# EAGLE design BATT_CPU (EAGLE 9.6.2)
COMPANY: ADAFRUIT INDUSTRIES; DRAWN: KTOWN; REV: B
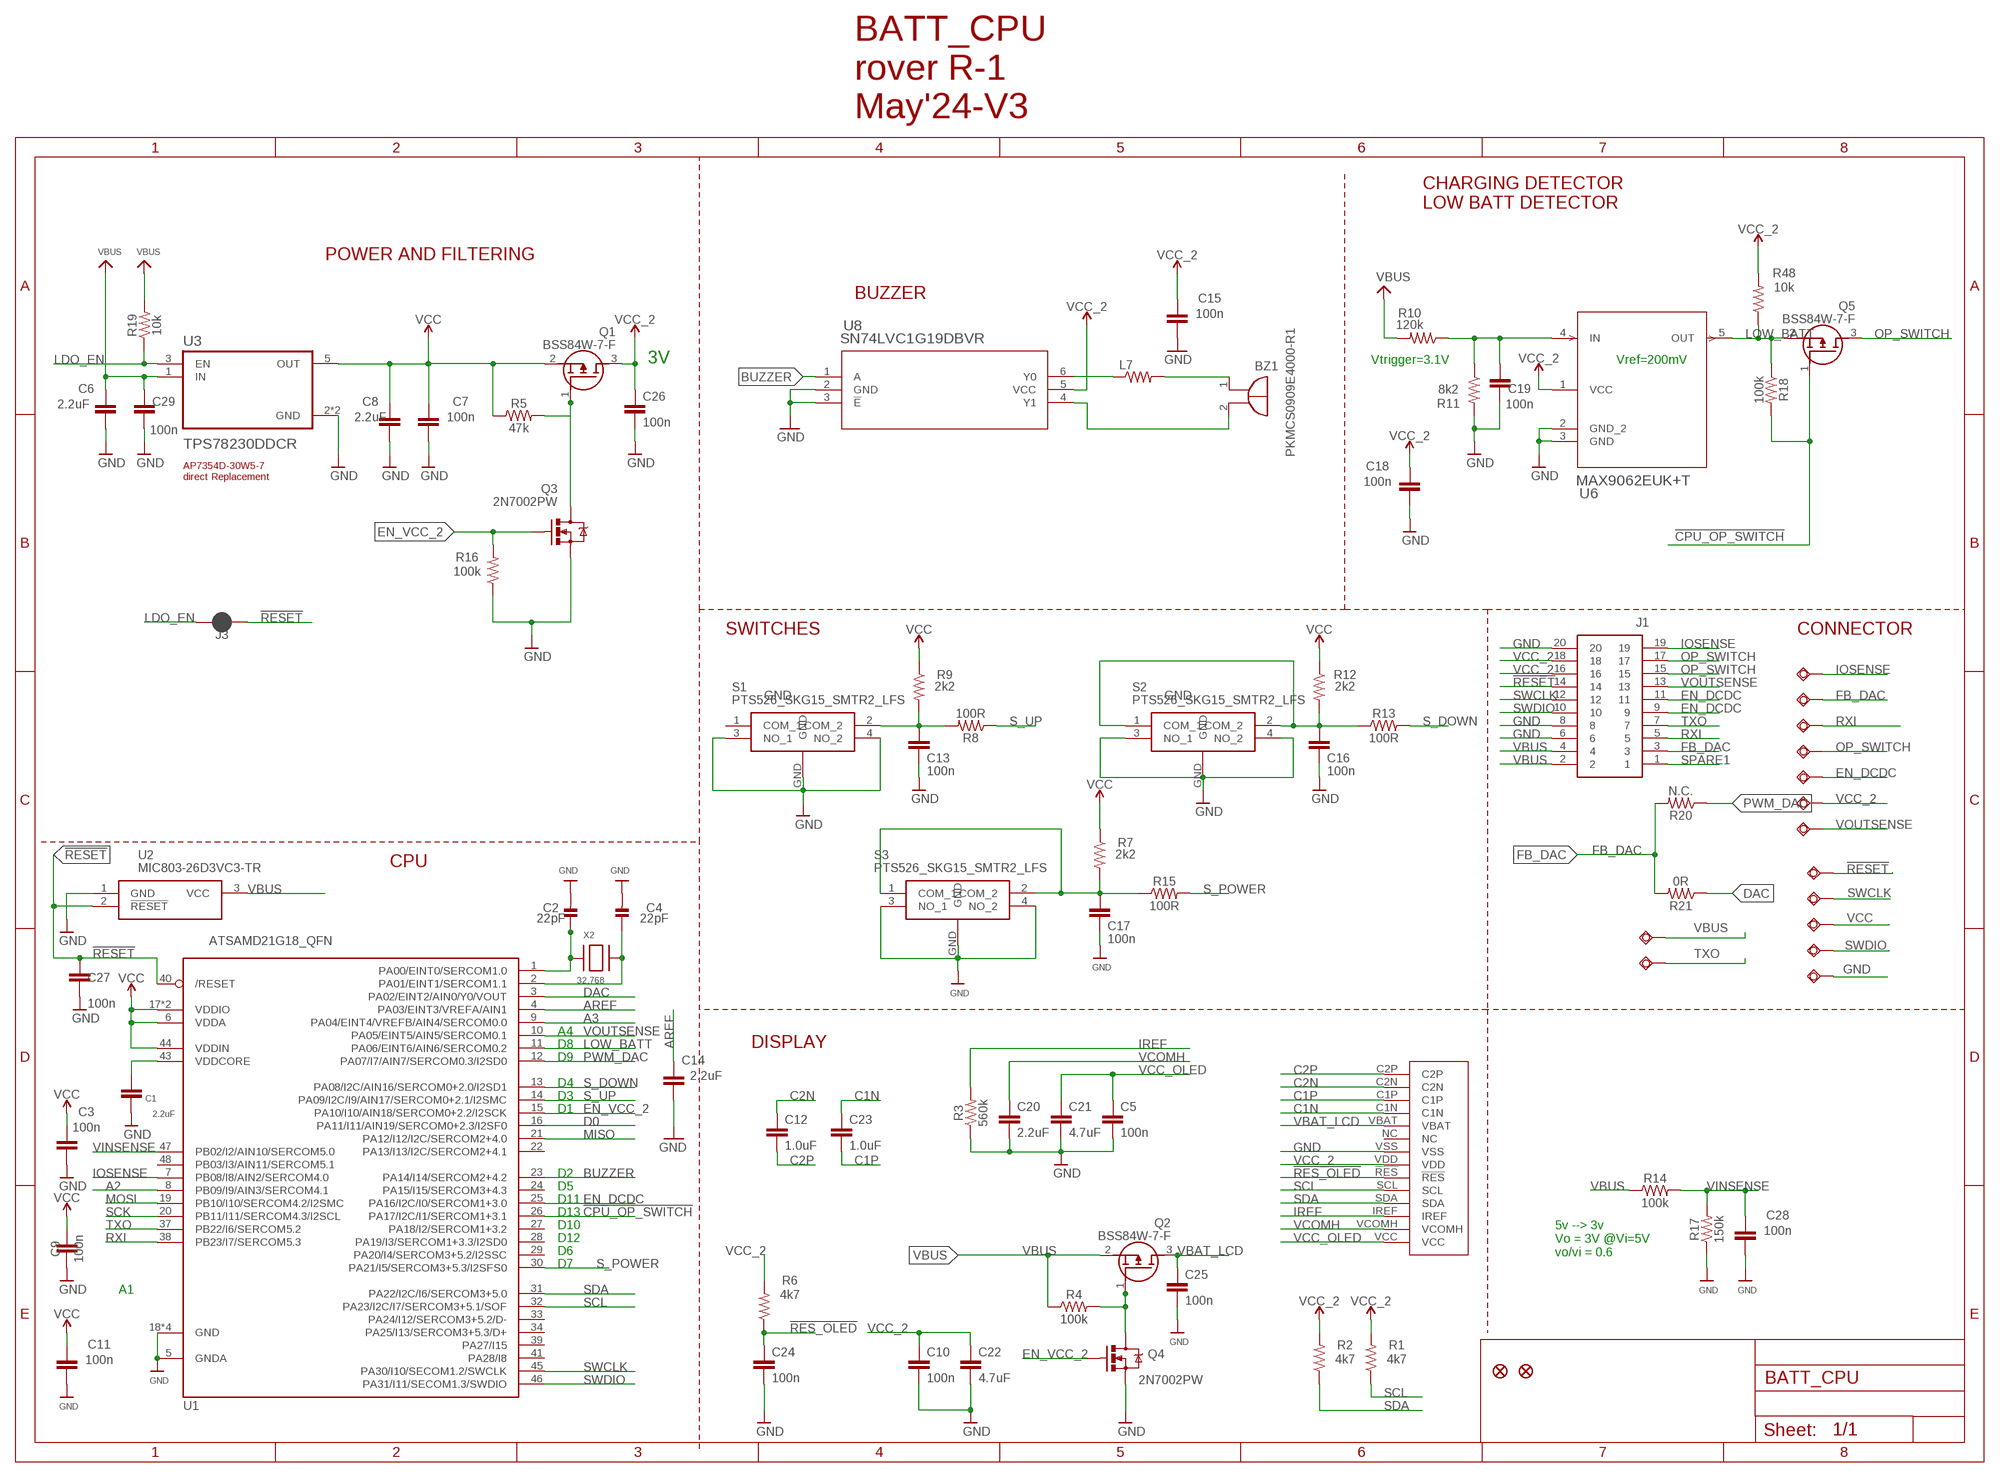
[diagram p0: schematic, sheet 1]

## Parts
BZ1  PKMCS0909E4000-R1  [PKMCS0909]
C1  2.2uF  2.2UF-0603-10V-20%  [0603]
C2  22pF  CAP_CERAMIC0603_NO  [0603-NO]
C3  100n  0.1UF-0402-16V-10%  [0402]
C4  22pF  CAP_CERAMIC0603_NO  [0603-NO]
C5  100n  0.1UF-0402-16V-10%  [0402]
C6  2.2uF  2.2UF-0603-10V-20%  [0603]
C7  100n  0.1UF-0402-16V-10%  [0402]
C8  2.2uF  2.2UF-0603-10V-20%  [0603]
C9  100n  0.1UF-0402-16V-10%  [0402]
C10  100n  0.1UF-0402-16V-10%  [0402]
C11  100n  0.1UF-0402-16V-10%  [0402]
C12  1.0uF  1.0UF-0402-16V-10%  [0402]
C13  100n  0.1UF-0402-16V-10%  [0402]
C14  2.2uF  2.2UF-0603-10V-20%  [0603]
C15  100n  0.1UF-0402-16V-10%  [0402]
C16  100n  0.1UF-0402-16V-10%  [0402]
C17  100n  0.1UF-0402-16V-10%  [0402]
C18  100n  0.1UF-0402-16V-10%  [0402]
C19  100n  0.1UF-0402-16V-10%  [0402]
C20  2.2uF  2.2UF-0603-10V-20%  [0603]
C21  4.7uF  4.7UF0603  [0603]
C22  4.7uF  4.7UF0603  [0603]
C23  1.0uF  1.0UF-0402-16V-10%  [0402]
C24  100n  0.1UF-0402-16V-10%  [0402]
C25  100n  0.1UF-0402-16V-10%  [0402]
C26  100n  0.1UF-0402-16V-10%  [0402]
C27  100n  0.1UF-0402-16V-10%  [0402]
C28  100n  0.1UF-0402-16V-10%  [0402]
C29  100n  0.1UF-0402-16V-10%  [0402]
EN_DCDC  TESTPAD_TPSQB1,27  [TESTPAD_B1,27]
FB_DAC  TESTPAD_TPSQB1,27  [TESTPAD_B1,27]
IOSENSE  TESTPAD_TPSQB1,27  [TESTPAD_B1,27]
J1  DF40C_2.0_-20DS-0.4V_51_  [DF40C2020DS04V51]
J3  N.C  JUMPER-SMT_2_NC_PASTE_SILK  [SMT-JUMPER_2_NC_PASTE_SILK]
L7  MMZ2012Y202BT000  RESISTOR0805-RES  [0805]
OP_SWITCH  TESTPAD_TPSQB1,27  [TESTPAD_B1,27]
Q1  BSS84W-7-F  [SOT65P222X110-3N]
Q2  BSS84W-7-F  [SOT65P222X110-3N]
Q3  2N7002PW  MOSFET-NCHANNEL2N7002PW  [SOT323]
Q4  2N7002PW  MOSFET-NCHANNEL2N7002PW  [SOT323]
Q5  BSS84W-7-F  [SOT65P222X110-3N]
R1  4k7  RESISTOR0402  [0402]
R2  4k7  RESISTOR0402  [0402]
R3  560k  RESISTOR0402  [0402]
R4  100k  RESISTOR0402  [0402]
R5  47k  RESISTOR0402  [0402]
R6  4k7  RESISTOR0402  [0402]
R7  2k2  RESISTOR0402  [0402]
R8  100R  RESISTOR0402  [0402]
R9  2k2  RESISTOR0402  [0402]
R10  120k  RESISTOR0402  [0402]
R11  8k2  RESISTOR0402  [0402]
R12  2k2  RESISTOR0402  [0402]
R13  100R  RESISTOR0402  [0402]
R14  100k  RESISTOR0402  [0402]
R15  100R  RESISTOR0402  [0402]
R16  100k  RESISTOR0402  [0402]
R17  150k  RESISTOR0402  [0402]
R18  100k  RESISTOR0402  [0402]
R19  10k  RESISTOR0402  [0402]
R20  N.C.  RESISTOR0402  [0402]
R21  0R  RESISTOR0402  [0402]
R48  10k  RESISTOR0402  [0402]
RXI  TESTPAD_TPSQB1,27  [TESTPAD_B1,27]
S1  PTS526_SKG15_SMTR2_LFS  [PTS526SKG15SMTR2LFS]
S2  PTS526_SKG15_SMTR2_LFS  [PTS526SKG15SMTR2LFS]
S3  PTS526_SKG15_SMTR2_LFS  [PTS526SKG15SMTR2LFS]
U1  ATSAMD21G18_QFN  ATSAMD21J_QFN  [TQFN48_7MM]
U2  MIC803-26D3VC3-TR  [SOT65P210X110-3N]
U3  TPS78230DDCR  [SOT95P280X110-5N]
U6  MAX9062EUK+T  [21-0057F_MXM]
U8  SN74LVC1G19DBVR  [DBV6]
U$30  64X32_OLED_049  [LCD_14_PINS]
U$34  FIDUCIAL""  [FIDUCIAL_1MM]
U$35  FIDUCIAL""  [FIDUCIAL_1MM]
VBUS  TESTPAD_TPSQB1,27  [TESTPAD_B1,27]
VBUS1  TESTPAD_TPSQB1,27  [TESTPAD_B1,27]
VBUS2  TESTPAD_TPSQB1,27  [TESTPAD_B1,27]
VBUS3  TESTPAD_TPSQB1,27  [TESTPAD_B1,27]
VBUS4  TESTPAD_TPSQB1,27  [TESTPAD_B1,27]
VBUS5  TESTPAD_TPSQB1,27  [TESTPAD_B1,27]
VBUS6  TESTPAD_TPSQB1,27  [TESTPAD_B1,27]
VCC_2  TESTPAD_TPSQB1,27  [TESTPAD_B1,27]
VOUTSENSE  TESTPAD_TPSQB1,27  [TESTPAD_B1,27]
X2  32.768  XTAL-3.2X1.5  [XTAL3215]

## Nets
!CPU_OP_SWITCH: Q5.1(G) R18.2 U1.26(PA17/I2C/I1/SERCOM1+3.1)
!RES_OLED: C24.1 R6.1 U$30.!RES
!RESET: C27.1 J1.14 J3.1 U1.40(/RESET) U2.2(!RESET) VBUS1.TP
A2: U1.8(PB09/I9/AIN3/SERCOM4.1)
A3: U1.9(PA04/EINT4/VREFB/AIN4/SERCOM0.0)
AREF: C14.1 U1.4(PA03/EINT3/VREFA/AIN1)
BUZZER: U1.23(PA14/I14/SERCOM2+4.2) U8.1(A)
C1N: C23.1 U$30.C1N
C1P: C23.2 U$30.C1P
C2N: C12.1 U$30.C2N
C2P: C12.2 U$30.C2P
D0: U1.16(PA11/I11/AIN19/SERCOM0+2.3/I2SF0)
DAC: R21.1 U1.3(PA02/EINT2/AIN0/Y0/VOUT)
EN_DCDC: EN_DCDC.TP J1.9 J1.11 U1.25(PA16/I2C/I0/SERCOM1+3.0)
EN_VCC_2: Q3.1(G) Q4.1(G) R16.2 U1.15(PA10/I10/AIN18/SERCOM0+2.2/I2SCK)
FB_DAC: FB_DAC.TP J1.3 R20.2 R21.2
GND: C1.2 C2.2 C3.2 C4.2 C5.2 C6.2 C7.2 C8.2 C9.2 C10.2 C11.2 C13.2 C14.2 C15.2 C16.2 C17.2 C18.2 C19.2 C20.2 C21.2 C22.2 C24.2 C25.2 C26.2 C27.2 C28.2 C29.2 J1.6 J1.8 J1.20 Q3.2(S) Q4.2(S) R3.1 R11.2 R16.1 R17.1 S1.3(NO_1) S1.4(NO_2) S1.GND S2.3(NO_1) S2.4(NO_2) S2.GND S3.3(NO_1) S3.4(NO_2) S3.GND U1.5(GNDA) U1.18(GND) U1.35(GND) U1.42(GND) U1.THERMAL(GND) U2.1(GND) U3.2(GND) U3.4(GND) U6.2(GND_2) U6.3(GND) U8.2(GND) U8.3(!E) U$30.VSS VBUS4.TP
IOSENSE: IOSENSE.TP J1.19 U1.7(PB08/I8/AIN2/SERCOM4.0)
IREF: R3.2 U$30.IREF
LDO_EN: J3.2 R19.1 U3.3(EN)
LOW_BATT: Q5.2(S) R18.1 R48.1 U1.11(PA06/EINT6/AIN6/SERCOM0.2) U6.5(OUT)
MISO: U1.21(PA12/I12/I2C/SERCOM2+4.0)
MOSI: U1.19(PB10/I10/SERCOM4.2/I2SMC)
N$1: C17.1 R7.2 R15.1 S3.1(COM_1) S3.2(COM_2)
N$2: C13.1 R8.2 R9.2 S1.2(COM_2)
N$3: C16.1 R12.2 R13.1 S2.1(COM_1) S2.2(COM_2)
N$4: Q2.1(G) Q4.3(D) R4.2
N$5: C2.1 U1.1(PA00/EINT0/SERCOM1.0) X2.P$1
N$6: Q1.1(G) Q3.3(D) R5.2
N$7: C4.1 U1.2(PA01/EINT1/SERCOM1.1) X2.P$2
N$10: C19.1 R10.1 R11.1 U6.4(IN)
N$17: L7.1 U8.6(Y0)
N$19: BZ1.1(+) L7.2
N$22: BZ1.2(-) U8.4(Y1)
OP_SWITCH: J1.15 J1.17 OP_SWITCH.TP Q5.3(D)
PWM_DAC: R20.1 U1.12(PA07/I7/AIN7/SERCOM0.3/I2SD0)
RXI: J1.5 RXI.TP U1.38(PB23/I7/SERCOM5.3)
S_DOWN: R13.2 U1.13(PA08/I2C/AIN16/SERCOM0+2.0/I2SD1)
S_POWER: R15.2 U1.30(PA21/I5/SERCOM3+5.3/I2SFS0)
S_UP: R8.1 U1.14(PA09/I2C/I9/AIN17/SERCOM0+2.1/I2SMC)
SCK: U1.20(PB11/I11/SERCOM4.3/I2SCL)
SCL: R1.1 U1.32(PA23/I2C/I7/SERCOM3+5.1/SOF) U$30.SCL
SDA: R2.1 U1.31(PA22/I2C/I6/SERCOM3+5.0) U$30.SDA
SPARE1: J1.1
SWCLK: J1.12 U1.45(PA30/I10/SECOM1.2/SWCLK) VBUS2.TP
SWDIO: J1.10 U1.46(PA31/I11/SECOM1.3/SWDIO) VBUS3.TP
TXO: J1.7 U1.37(PB22/I6/SERCOM5.2) VBUS6.TP
VBAT_LCD: C25.1 Q2.3(D) U$30.VBAT
VBUS: C6.1 C29.1 J1.2 J1.4 Q2.2(S) R4.1 R10.2 R14.1 R19.2 U2.3(VCC) U3.1(IN) VBUS5.TP
VCC: C3.1 C7.1 C8.1 C9.1 C11.1 Q1.2(S) R5.1 R7.1 R9.1 R12.1 R48.2 U1.6(VDDA) U1.17(VDDIO) U1.36(VDDIO) U1.44(VDDIN) U3.5(OUT) VBUS.TP ; supply symbol labelled VCC_2
VCC_2: C10.1 C15.1 C18.1 C22.1 C26.1 J1.16 J1.18 Q1.3(D) R1.2 R2.2 R6.2 U6.1(VCC) U8.5(VCC) U$30.VDD VCC_2.TP
VCC_OLED: C5.1 C21.1 U$30.VCC
VCOMH: C20.1 U$30.VCOMH
VDDCORE: C1.1 U1.43(VDDCORE)
VINSENSE: C28.1 R14.2 R17.2 U1.47(PB02/I2/AIN10/SERCOM5.0)
VOUTSENSE: J1.13 U1.10(PA05/EINT5/AIN5/SERCOM0.1) VOUTSENSE.TP
Unconnected: S1.1(COM_1) U1.22(PA13/I13/I2C/SERCOM2+4.1) U1.24(PA15/I15/SERCOM3+4.3) U1.27(PA18/I2/SERCOM1+3.2) U1.28(PA19/I3/SERCOM1+3.3/I2SD0) U1.29(PA20/I4/SERCOM3+5.2/I2SSC) U1.33(PA24/I12/SERCOM3+5.2/D-) U1.34(PA25/I13/SERCOM3+5.3/D+) U1.39(PA27/I15) U1.41(PA28/I8) U1.48(PB03/I3/AIN11/SERCOM5.1) U$30.NC

## Notes on the sheet
- BATT_CPU
  rover R-1
  May'24-V3
- CHARGING DETECTOR
  LOW BATT DETECTOR
- POWER AND FILTERING
- BUZZER
- 3V | Vtrigger=3.1V | Vref=200mV
- AP7354D-30W5-7 
  direct Replacement
- SWITCHES | CONNECTOR
- CPU
- A4
- D8 | DISPLAY
- D9
- D4
- D3
- D1
- D2
- D5
- D11
- D13
- D10
- D12
- D6
- D7
- 5v --> 3v
  Vo = 3V @Vi=5V
  vo/vi = 0.6
- A1

## Library data of the parts
BZ1 = buzzer:PKMCS0909E4000-R1: PKMCS0909E4000-R1 Source : http://www.murata.com/~/media/webrenewal/products/sound/sounder/vppt-buzj083-d.ashx
C1 C6 C8 C14 C20 = SparkFun-Capacitors:2.2UF: 2.2µF ceramic capacitors A capacitor is a passive two-terminal electrical component used to store electrical energy temporarily in an electric field.; PROD_ID: CAP-07888
C2 C4 = microbuilder:CAP_CERAMIC: Ceramic Capacitors For new designs, use the packages preceded by an '_' character since they are more reliable: The following footprints should be used on most boards: _0402 - Standard footprint for regular board layouts _0603 - Standard footprint for regular board layouts _0805 - Standard footprint for regular board layouts _1206 - Standard footprint for regular board layouts For extremely tight-pitch boards where space is at a premium, the following 'micro-pitch' footprints can be used (smaller pads, no silkscreen outline, etc.): _0402MP - Micro-pitch footprint for very dense/compact boards _0603MP - Micro-pitch footprint for very dense/compact boards _0805MP - Micro-pitch footprint for very dense/compact boards _1206MP - Micro-pitch footprint for very dense/compact boards
C3 C5 C7 C9-C11 C13 C15-C19 C24-C29 = SparkFun-Capacitors:0.1UF: 0.1µF ceramic capacitors A capacitor is a passive two-terminal electrical component used to store electrical energy temporarily in an electric field.; PROD_ID: CAP-12416; VALUE: 0.1uF
C12 C23 = SparkFun-Capacitors:1.0UF: 1µF ceramic capacitors A capacitor is a passive two-terminal electrical component used to store electrical energy temporarily in an electric field.; PROD_ID: CAP-12417
C21 C22 = SparkFun-Capacitors:4.7UF: 4.7µF ceramic capacitors A capacitor is a passive two-terminal electrical component used to store electrical energy temporarily in an electric field.; PROD_ID: CAP-08280
EN_DCDC FB_DAC IOSENSE OP_SWITCH RXI VBUS VBUS1-VBUS6 VCC_2 VOUTSENSE = BeagleBone_Blue_R3:TESTPAD_TPSQ: Test pad
J1 = DF40C_2.0_-20DS-0.4V_51_:DF40C_2.0_-20DS-0.4V_51_: Board to Board & Mezzanine Connectors 20P 2-ROW RECEPT VERT SMT 2.0MM HGHT Source: Datasheet <https://www.hirose.com/product/document?clcode=CL0684-4003-3-51&productname=DF40C-60DP-0.4V(51)&series=DF40&documenttype=Catalog&lang=en&documentid=D31649_en>; DESCRIPTION: Board to Board & Mezzanine Connectors 20P 2-ROW RECEPT VERT SMT 2.0MM HGHT; HEIGHT: 2.1mm; MANUFACTURER_NAME: Hirose; MANUFACTURER_PART_NUMBER: DF40C(2.0)-20DS-0.4V(51); MOUSER_PART_NUMBER: 798-DF40C2020DS04V51; MOUSER_PRICE-STOCK: https://www.mouser.co.uk/ProductDetail/Hirose-Connector/DF40C2.0-20DS-0.4V51?qs=3aug5cyrIbdA5dYbMRd5pw%3D%3D
J3 = SparkFun-Jumpers:JUMPER-SMT_2_NC_PASTE: Normally closed solder jumper This jumper has an aperture in the stencil to allow solder paste to bridge the split in the wire so it's normally closed (NC). Wick off the solder to open the connection. Reapply solder to reclose the connection.
L7 = SparkFun:RESISTOR: Resistor Basic schematic elements and footprints for 0603, 1206, and PTH resistors.
Q1 Q2 Q5 = BSS84W-7-F:BSS84W-7-F: Lattice Source: Datasheet <https://www.diodes.com/assets/Datasheets/BSS84W.pdf>; DESCRIPTION: Lattice; HEIGHT: 1.1mm; MANUFACTURER_NAME: Lattice Semiconductor; MANUFACTURER_PART_NUMBER: BSS84W-7-F; MOUSER_PART_NUMBER: N/A; MOUSER_PRICE-STOCK: https://www.mouser.com/Search/Refine.aspx?Keyword=N%2FA
Q3 Q4 = SparkFun-DiscreteSemi:MOSFET-NCHANNEL: Common NMOSFET Parts MFG P/N Store ID Prod ID FDD8780 TRANS-09984 SI7820DN TRANS-11055 FDS6630A IC-08089 2N7002PW TRANS-11151 FQP30N06L COM-10213 TRANS-10060 BSS123LT1G TRANS-08345 BSS138 TRANS-00830 BS170 2N7000; PROD_ID: TRANS-11151
R1-R21 R48 = SparkFun-Resistors:RESISTOR: Generic Resistor Package
S1-S3 = PTS526_SKG15_SMTR2_LFS:PTS526_SKG15_SMTR2_LFS: Tact 5.2 x 5.2, 1.5 mm H, 260gf, G leads, Ground pin, metal actuator Source: Datasheet <https://www.arrow.com/en/products/pts526-skg15-smtr2-lfs/ck>; ARROW_PART_NUMBER: PTS526 SKG15 SMTR2 LFS; ARROW_PRICE-STOCK: https://www.arrow.com/en/products/pts526-skg15-smtr2-lfs/ck?region=nac; DESCRIPTION: Tact 5.2 x 5.2, 1.5 mm H, 260gf, G leads, Ground pin, metal actuator; HEIGHT: 1.6mm; MANUFACTURER_NAME: C & K COMPONENTS; MANUFACTURER_PART_NUMBER: PTS526 SKG15 SMTR2 LFS; MOUSER_PART_NUMBER: 611-PTS526SKG15SMR2L; MOUSER_PRICE-STOCK: https://www.mouser.co.uk/ProductDetail/CK/PTS526-SKG15-SMTR2-LFS?qs=UXgszm6BlbEc7nn5s4cd2Q%3D%3D
U1 = microbuilder:ATSAMD21J
U2 = MIC803-26D3VC3-TR:MIC803-26D3VC3-TR: Supervisory Circuits Source: Datasheet <https://www.mouser.com/datasheet/2/268/mic803-778690.pdf>; DESCRIPTION: Supervisory Circuits; HEIGHT: 1.1mm; MANUFACTURER_NAME: Microchip; MANUFACTURER_PART_NUMBER: MIC803-26D3VC3-TR; MOUSER_PART_NUMBER: 998-MIC803-26D3VC3TR; MOUSER_PRICE-STOCK: https://www.mouser.co.uk/ProductDetail/Microchip-Technology-Micrel/MIC803-26D3VC3-TR?qs=Y3Q3JoKAO1QfnxnYOR7kig%3D%3D
U3 = TPS78230DDCR:TPS78230DDCR: Check prices <https://pricing.snapeda.com/parts/TPS78230DDCR/Texas%20Instruments/view-part?ref=eda>; AVAILABILITY: Good; DESCRIPTION: 150-mA, nano-IQ, low-dropout voltage regulator with enable from -40C to +125C 5-SOT-23-THIN -40 to 125; MF: Texas Instruments; MP: TPS78230DDCR; PACKAGE: SOT-23-THN-5 Texas Instruments; PRICE: None; PURCHASE-URL: https://pricing.snapeda.com/search/part/TPS78230DDCR/?ref=eda
U6 = MAX9062:MAX9062EUK+T; BUILT_BY: EMA_UL_Team; MANUFACTURER_PART_NUMBER: MAX9062EUK+T; SOURCELIBRARY: Maxim_2014-06-20; VENDOR: Maxim Integrated Products
U8 = SN74LVC1G19DBVR:SN74LVC1G19DBVR; DATASHEET_URL: http://www.ti.com/lit/gpn/SN74LVC1G19; DESCRIPTION: 1-of-2 Decoder/Demultiplexer; FAMILY_NAME: LL Decoder, Mux/Demux; GENERIC_PART_NUMBER: SN74LVC1G19; INDUSTRY_STD_PKG_TYPE: SOT-23; MANUFACTURER: Texas Instruments; MANUFACTURER_PART_NUMBER: SN74LVC1G19DBVR; PACKAGE_DESIGNATOR: DBV; PIN_COUNT: 6; VENDOR: Texas Instruments
U$30 = OLED 66 64x48:64X32_OLED_049
U$34 U$35 = microbuilder:FIDUCIAL: Fiducial Alignment Points Various fiducial points for machine vision alignment.; BOM: EXCLUDE
X2 = adafruit2:XTAL: Low cost SMT crystals, no capacitors included http://www.ladyada.net/library/eagle

## Net classes
2 gnd: width 0.305 mm, drill 0.483 mm, clearance 0.203 mm

## Board
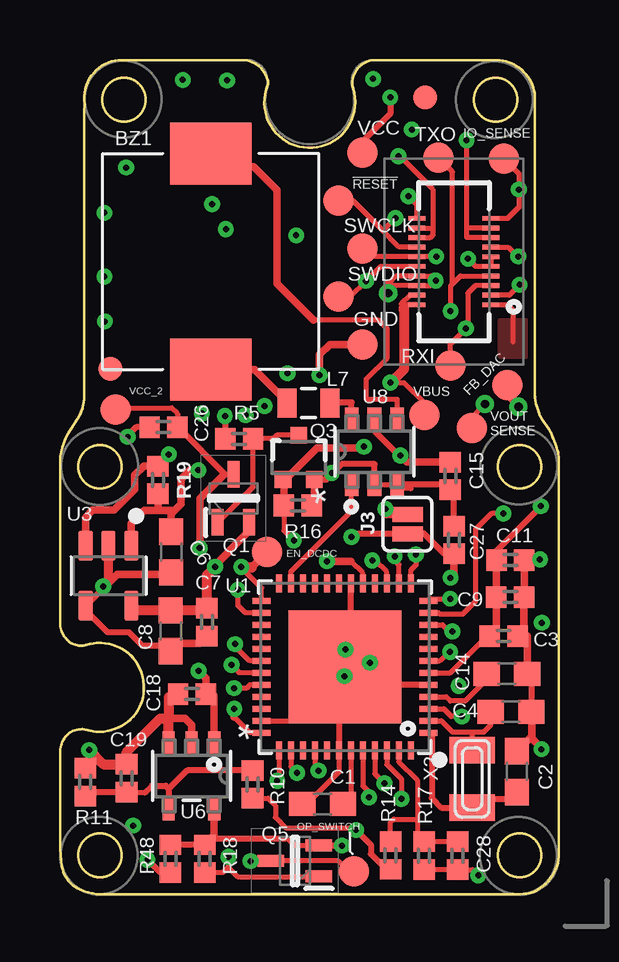
[diagram p1: board, top side]
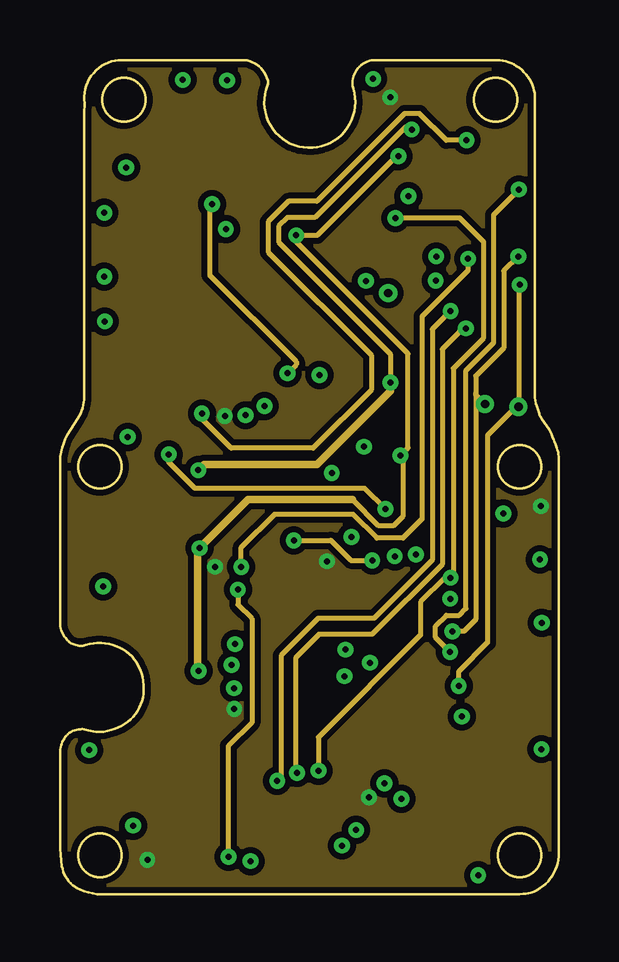
[diagram p2: board, inner layer Route2]
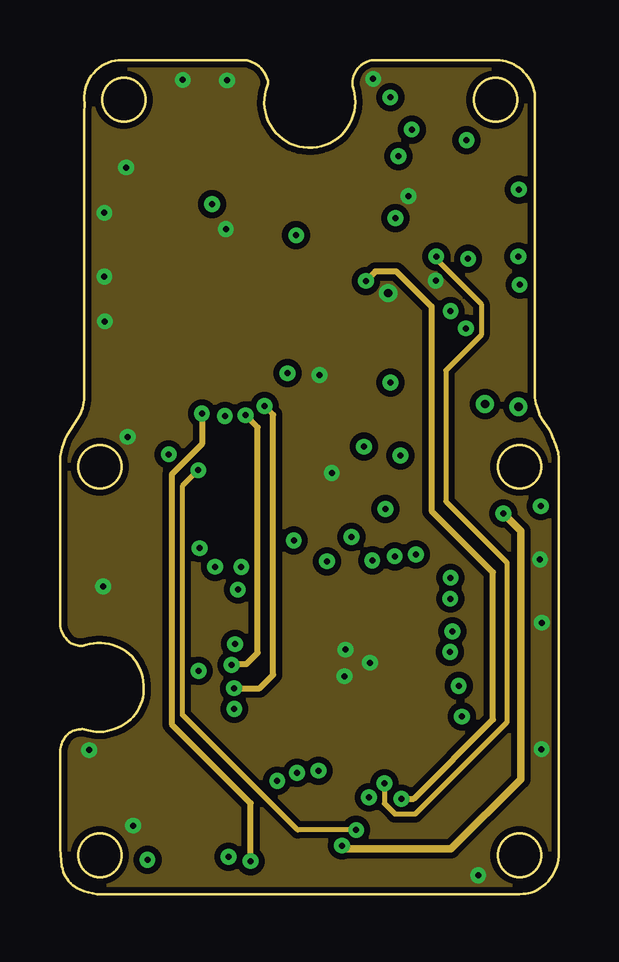
[diagram p3: board, inner layer GND]
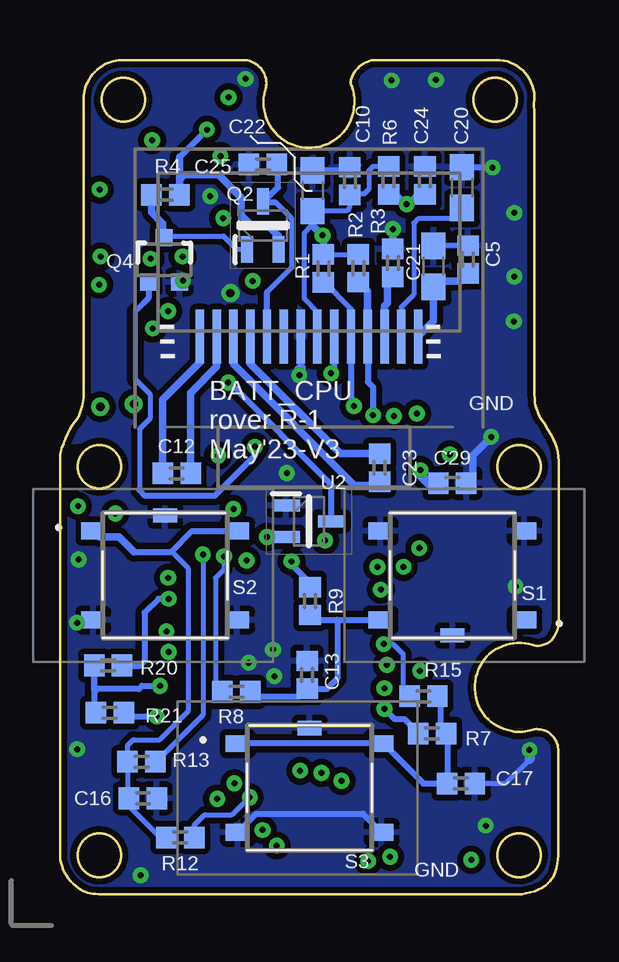
[diagram p4: board, bottom side, seen from below]

Size 20.8 x 34.78 mm. Coordinates in mm from the lower left corner, seen from the top.
Outline: 7.81,34.77 2.6,34.78 arc99 1.03,32.97 1.02,32.57 1.02,21.34 arc-3 1,20.62 arc-31 0.74,19.84 arc4 0.31,19.14 arc31 0,17.87 0,11.35 arc48 0.36,10.55 arc58 1.08,10.39 arc-37 2.36,10.34 arc-41 3.27,9.53 arc-39 3.46,8.21 arc-46 2.7,7.1 arc-24 1.83,6.78 arc-26 1.18,6.84 arc65 0.27,6.61 arc38 0.02,6.05 0.02,1.89 arc10 0.08,1.17 arc56 0.83,0.2 arc27 1.92,0 18.85,0 arc2 19.32,0.01 arc33 20.04,0.26 arc26 20.6,0.9 arc24 20.8,1.58 20.8,18.16 arc21 20.72,18.6 arc-1 20.65,18.79 arc1 20.56,19.03 arc19 20.09,19.82 arc-27 19.98,20.04 arc9 19.92,20.23 arc-24 19.81,20.83 19.81,33.17 arc26 19.65,33.85 arc31 19.04,34.53 arc31 18.22,34.78 13.18,34.78 arc83 12.2,33.91 arc24 12.23,33.58 arc-219 8.65,33.72 arc39 8.66,33.96 arc59 7.81,34.77
Outline: circle at 18.16,33.13 radius 0.9
Outline: circle at 19.16,17.83 radius 0.9
Outline: circle at 19.16,1.63 radius 0.9
Outline: circle at 1.66,1.63 radius 0.9
Outline: circle at 1.66,17.83 radius 0.9
Outline: circle at 2.66,33.13 radius 0.9
Copper layers (1+2*15+16): Top 0.035mm / dielectric 1.5mm / Route2 0.035mm / dielectric 0.15mm / GND 0.035mm / dielectric 0.2mm / Bottom 0.035mm
Design rules "adafruit *": minimum track width 8mil, minimum drill 0.25mm, track to track 8mil, track to pad 8mil, pad to pad 8mil, via to via 8mil, smd to smd 5mil, copper to edge 10mil, drill to drill 8mil, minimum pad ring 10mil, minimum via ring 8mil, stop-mask expansion 2mil, vias tented up to drill 20mil, thermal gap 10mil
bRestrict: area 20,17.1 to 20.7,18.5

### Footprints (pad centres in the part's own frame; a part is rotated, then mirrored left to right if it is on the bottom)
PKMCS0909 = smd 2.6 x 3.4: 1 -4.5,0; 2 4.5,0
0603 = smd 1.1 x 1: 1 -0.85,0; 2 0.85,0
0603-NO = smd 1.1 x 1: 1 -0.85,0; 2 0.85,0
0402 = smd 0.85 x 0.9: 1 -0.58,0; 2 0.58,0
TESTPAD_B1,27 = smd 1.27 x 1.27: TP 0,0
DF40C2020DS04V51 = smd 0.2 x 0.7: 1 -1.8,-1.54; 2 -1.8,1.54; 3 -1.4,-1.54; 4 -1.4,1.54; 5 -1,-1.54; 6 -1,1.54; 7 -0.6,-1.54; 8 -0.6,1.54; 9 -0.2,-1.54; 10 -0.2,1.54; 11 0.2,-1.54; 12 0.2,1.54; 13 0.6,-1.54; 14 0.6,1.54; 15 1,-1.54; 16 1,1.54; 17 1.4,-1.54; 18 1.4,1.54; 19 1.8,-1.54; 20 1.8,1.54
SMT-JUMPER_2_NC_PASTE_SILK = smd 0.635 x 1.27: 1 -0.406,0; 2 0.406,0
0805 = smd 0.8 x 1.2: 1 -0.9,0; 2 0.9,0
SOT65P222X110-3N = smd 1.1 x 0.5: 1 -1,0.65; 2 -1,-0.65; 3 1,0
SOT323 = smd 0.7 x 0.7: 1 -0.65,-0.925; 2 0.65,-0.925; 3 0,0.925
PTS526SKG15SMTR2LFS = smd 1 x 0.7: 1 -3,1.85; 2 3,1.85; 3 -3,-1.85; 4 3,-1.85 | smd 1 x 0.6: GND 0,2.5
TQFN48_7MM = smd 0.25 x 0.75: 1 -2.75,-3.475; 2 -2.25,-3.475; 3 -1.75,-3.475; 4 -1.25,-3.475; 5 -0.75,-3.475; 6 -0.25,-3.475; 7 0.25,-3.475; 8 0.75,-3.475; 9 1.25,-3.475; 10 1.75,-3.475; 11 2.25,-3.475; 12 2.75,-3.475; 25 2.75,3.475; 26 2.25,3.475; 27 1.75,3.475; 28 1.25,3.475; 29 0.75,3.475; 30 0.25,3.475; 31 -0.25,3.475; 32 -0.75,3.475; 33 -1.25,3.475; 34 -1.75,3.475; 35 -2.25,3.475; 36 -2.75,3.475 | smd 0.75 x 0.25: 13 3.475,-2.75; 14 3.475,-2.25; 15 3.475,-1.75; 16 3.475,-1.25; 17 3.475,-0.75; 18 3.475,-0.25; 19 3.475,0.25; 20 3.475,0.75; 21 3.475,1.25; 22 3.475,1.75; 23 3.475,2.25; 24 3.475,2.75; 37 -3.475,2.75; 38 -3.475,2.25; 39 -3.475,1.75; 40 -3.475,1.25; 41 -3.475,0.75; 42 -3.475,0.25; 43 -3.475,-0.25; 44 -3.475,-0.75; 45 -3.475,-1.25; 46 -3.475,-1.75; 47 -3.475,-2.25; 48 -3.475,-2.75 | smd 4.7 x 4.7: THERMAL 0,0
SOT65P210X110-3N = smd 1.15 x 0.5: 1 -0.95,0.65; 2 -0.95,-0.65; 3 0.95,0
SOT95P280X110-5N = smd 1.25 x 0.59: 1 -1.255,0.95; 2 -1.255,0; 3 -1.255,-0.95; 4 1.255,-0.95; 5 1.255,0.95
21-0057F_MXM = smd 0.972 x 0.508: 1 -1.362,0.95; 2 -1.362,0; 3 -1.362,-0.95; 4 1.362,-0.95; 5 1.362,0.95
DBV6 = smd 0.972 x 0.568: 1 -1.362,0.95; 2 -1.362,0; 3 -1.362,-0.95; 4 1.362,-0.95; 5 1.362,0; 6 1.362,0.95
LCD_14_PINS = smd 0.35 x 2.25: !RES 5.6,1.125; C1N 2.1,1.125; C1P 1.4,1.125; C2N 0.7,1.125; C2P 0,1.125; IREF 7.7,1.125; NC 3.5,1.125; SCL 6.3,1.125; SDA 7,1.125; VBAT 2.8,1.125; VCC 9.1,1.125; VCOMH 8.4,1.125; VDD 4.9,1.125; VSS 4.2,1.125
FIDUCIAL_1MM = smd 1 x 1: 1 0,0
XTAL3215 = smd 1.1 x 1.9: P$1 1.2,0; P$2 -1.2,0

### Placement (x,y rotation side)
BZ1  6.29,26.38 90 top
C1  10.95,3.77 180 top
C2  19.06,5.12 90 top
C3  18.5,10.77 0 top
C4  18.81,7.61 0 top
C5  3.78,26.46 90 bottom
C6  4.64,14.27 270 top
C7  6.13,11.35 270 top
C8  4.61,10.99 270 top
C9  18.77,12.39 0 top
C10  8.71,29.73 90 bottom
C11  18.78,13.93 0 top
C12  15.93,17.55 180 bottom
C13  10.49,9.15 90 bottom
C14  18.64,9.2 0 top
C15  16.27,17.44 270 top
C16  17.34,4 0 bottom
C17  4.08,4.62 0 bottom
C18  5.51,8.35 180 top
C19  2.78,4.84 90 top
C20  4.03,29.46 90 bottom
C21  5.22,26.18 90 bottom
C22  10.26,29.33 90 bottom
C23  7.47,17.78 270 bottom
C24  5.58,29.76 90 bottom
C25  12.34,30.42 180 bottom
C26  4.32,19.47 180 top
C27  16.43,14.77 90 top
C28  16.58,1.61 270 top
C29  4.44,17.14 0 bottom
EN_DCDC  8.63,14.26 0 top
FB_DAC  18.66,21.22 0 top
IOSENSE  18.52,30.67 0 top
J1  16.43,26.38 90 top
J3  14.49,15.43 90 top
L7  10.37,20.48 180 top
OP_SWITCH  12.27,0.96 0 top
Q1  7.23,16.51 90 top
Q2  12.34,27.88 90 bottom
Q3  9.96,18.21 0 top
Q4  16.46,26.45 0 bottom
Q5  9.8,1.39 180 top
R1  9.82,26.09 90 bottom
R2  8.36,26.1 90 bottom
R3  6.92,26.32 270 bottom
R4  16.4,29.16 180 bottom
R5  7.47,18.99 0 top
R6  7.1,29.76 90 bottom
R7  5.28,6.7 0 bottom
R8  13.45,8.44 0 bottom
R9  10.37,12.23 270 bottom
R10  8.03,4.59 270 top
R11  1.06,4.68 90 top
R12  15.78,2.37 180 bottom
R13  17.4,5.53 0 bottom
R14  13.79,1.62 90 top
R15  5.64,8.26 180 bottom
R16  9.92,16.21 180 top
R17  15.18,1.61 90 top
R18  6.04,1.48 270 top
R19  4.09,17.27 270 top
R20  18.79,9.54 180 bottom
R21  18.72,7.57 180 bottom
R48  4.61,1.49 270 top
RXI  16.28,22.05 0 top
S1  4.43,13.29 180 bottom
S2  16.41,13.29 0 bottom
S3  10.39,4.44 0 bottom
U1  11.88,9.48 90 top
U2  10.42,15.55 0 bottom
U3  2.02,13.29 270 top
U6  5.49,4.94 270 top
U8  13.12,18.45 90 top
U$30  14.96,22.12 0 bottom
U$34  15.23,33.21 0 top
U$35  2.11,21.92 0 top
VBUS  12.61,30.91 0 top
VBUS1  11.61,28.91 0 top
VBUS2  12.61,26.91 0 top
VBUS3  11.61,24.91 0 top
VBUS4  12.61,22.92 0 top
VBUS5  15.19,19.98 0 top
VBUS6  15.78,30.71 0 top
VCC_2  2.32,20.21 0 top
VOUTSENSE  17.17,19.43 0 top
X2  17.2,4.81 270 top

### Tracks (layer width: path | path; a pad name or v marks a point on that pad's centre or on a via)
!CPU_OP_SWITCH  (via drill 0.25)
  Top 0.203: U1.26 7.73,11.73 7.42,12.04 v7.42,12.7 | R18.2 6.79,0.9 7.03,1.14 v7.03,1.56 7.03,1.11 7.43,0.71 10.77,0.71 Q5.1
  Route2 0.203: v7.03,1.56 7.03,6.18 8,7.15 8,11.49 7.42,12.07 v7.42,12.7
!RES_OLED  (via drill 0.25)
  Route2 0.203: v9.49,21.72 9.86,22.09 9.86,22.2 6.24,25.82 6.24,28.68 v6.34,28.78
  Bottom 0.203: C24.1 5.94,29.18 v6.34,28.78 6.75,29.18 R6.1
  Bottom 0.254: U$30.!RES 9.36,21.85 v9.49,21.72
!RESET  (via drill 0.25)
  Top 0.203: v10.78,5.16 10.63,5.31 U1.40 | J1.14 14.14,26.99 13.41,27.72 | VBUS1.TP 12.22,28.91 13.41,27.72 | 13.41,27.72 13.52,27.72 v13.99,28.19
  Top 0.254: J3.1 12.28,15.01 v12.16,14.89 | C27.1 16.03,14.19 15.18,15.05 14.51,15.05 J3.1
  Top 0.305: C27.1 16.43,13.34 v16.29,13.2 | J3.1
  Route2 0.203: v10.78,5.16 10.78,6.55 15.04,10.81 15.04,12.19 16.05,13.2 v16.29,13.2 16.4,13.31 16.4,21.92 17.67,23.19 17.67,27.19 16.67,28.19 v13.99,28.19
  Bottom 0.203: v12.16,14.89 U2.2
AREF
  Top 0.203: C14.1 17.79,8.94 16.9,8.05 16.28,8.05 16.1,8.23 U1.4
BUZZER
  Top 0.203: U1.23 9.63,13.46 12.17,15.99 U8.1
C1N
  Bottom 0.305: C23.1 9.11,18.37 12.86,22.13 U$30.C1N
C1P
  Bottom 0.305: C23.2 7.63,17.04 8.51,17.04 13.56,22.1 U$30.C1P
C2N
  Bottom 0.203: C12.1
  Bottom 0.305: U$30.C2N 14.26,22 15.36,20.9 C12.1
C2P
  Bottom 0.305: C12.2 16.51,20.63 14.96,22.18 U$30.C2P
DAC  (via drill 0.25)
  Top 0.203: v16.76,7.41 16.32,7.41 16,7.73 U1.3
  Bottom 0.254: R21.1 17.98,7.41 v16.76,7.41
EN_DCDC  (via drill 0.25)
  Top 0.203: U1.25 8.41,12.77 7.56,13.62 v7.56,13.64 | v17.02,26.49 17.34,26.17 17.34,26.18 J1.9 J1.11
  Top 0.305: EN_DCDC.TP 7.99,13.62
  Top 0.406: 7.99,13.62 7.56,13.62
  Route2 0.203: v7.56,13.64 7.56,14.46 8.94,15.84 12.22,15.84 13.21,14.85 14.31,14.85 15.1,15.65 15.1,24.09 17.02,26 v17.02,26.49
EN_VCC_2  (via drill 0.25)
  Top 0.203: U1.15 13.63,13.43 13.14,13.92 v13.02,13.92 | Q3.1 9.34,17.26 | R16.2 9.34,15.16 v9.75,14.75
  Top 0.305: 9.34,17.26 R16.2 9.34,17.23 10.71,18.6 12.61,18.6 v12.67,18.66
  Route2 0.203: v9.75,14.75 11.3,14.75 12.13,13.93 12.12,13.92 v13.02,13.92
  Bottom 0.203: 17.32,24.64 17.66,24.3 17.66,21.47 17.04,20.86 17.04,19.84 17.48,19.39 17.48,16.85
  Bottom 0.254: 17.32,24.64 17.11,24.85 Q4.1 | 17.48,16.85 17.25,16.62 14.35,16.62 12.67,18.29 v12.67,18.66
FB_DAC  (via drill 0.25, 0.35)
  Top 0.203: v19.17,25.41 18.73,24.98 J1.3 | FB_DAC.TP 18.66,20.78 v19.12,20.32
  Route2 0.203: v16.63,8.69 16.63,9.29 17.83,10.49 17.83,19.13 19.02,20.32 v19.12,20.32 19.14,20.34 19.14,25.38 v19.17,25.41
  Bottom 0.254: v16.63,8.69 17.38,8.69 17.51,8.56 19.33,8.56 19.33,8.45 19.37,8.49 R20.2 19.37,7.64 R21.2
GND  (via drill 0.25, 0.35)
  Top 0.203: U3.4 1.13,12.08 1.13,11.77 | 2.02,12.98 2.06,13.02 | R16.1 10.61,16.32 | C14.2 19.67,9.02 | 19.67,7.6 C4.2 | U1.42 11.63,5.1 10.3,3.77 C1.2 | R17.1 15.18,1.21 15.36,1.03 C28.2 17.2,1.03 v17.44,0.8 | 1.22,5.43 R11.2 | U1.THERMAL 12.7,9.48 13.45,8.73 | U1.THERMAL 11.86,9.46 v11.86,9.09 10,7.23 U1.35 | U1.THERMAL 11.63,9.23 | U1.THERMAL 12.13,9.73 | v2.82,19.07 2.82,19.12 | 19.36,12.4 C9.2 | 19.35,11.04 C3.2 19.49,10.77 | 4.38,10.37 C8.2 4.61,10.38 4.7,10.47 | 5.83,10.47 C7.2 | v20.08,6.05 20.08,6.08 | 19.67,6.5 19.67,6.6 | C18.2 4.66,8.35 | J1.20 14.89,28.74 v14.53,29.1 | U8.2 14.46,17.09 14.62,16.93 | J1.8 13.99,25.77 13.69,25.46 13.78,25.38 J1.6 15.46,25.38 v15.67,25.58 15.47,25.78 J1.8
  Top 0.254: 1.13,12.08 2.02,12.98 | 2.06,13.02 2.06,14.5 U3.2 | C6.2 4.26,13.42 4.18,13.34 | 1.13,11.77 1.98,10.92 2.88,10.92 3.44,10.37 4.38,10.37 | 19.67,6.6 19.67,6.63 | 19.67,7.6 19.67,9.02 | U1.5 13.45,8.73 | 11.63,9.23 U1.42 | 12.13,9.73 U1.18 | C26.2 3.17,19.47 2.82,19.12 | U8.2 13.12,17.94 11.75,17.94 11.1,17.29 Q3.2 11.06,17.29 v11.34,17.57 | 14.62,16.93 13.91,16.93 U8.3 16.04,17.09 C15.2 16.43,16.7 C27.2 | C11.2 20.02,13.93 v20.02,13.96
  Top 0.305: 2.06,13.02 2.39,13.34 4.18,13.34 | 10.61,16.32 Q3.2 | 19.49,10.77 C14.2 | C2.2 19.67,6.58 19.67,6.63 19.67,7.6 | U6.2 5.49,7.07 5.22,7.33 4.54,7.33 | v1.22,6.01 1.22,5.43 | VBUS4.TP 11.25,22.92 10.82,22.49 v10.82,21.64 | C11.2 19.36,12.4 | C9.2 19.35,11.04 | 4.7,10.47 5.83,10.47 | 20.08,6.08 19.67,6.5 | 4.66,8.35 4.54,8.23 | 13.69,25.46 v13.69,25.06 | U3.2 1.98,14.5 1.98,13.01 v1.8,12.83
  Top 0.406: U6.3 4.54,7.33 | 4.54,8.23 4.54,7.33 | 4.54,7.33 4.18,7.33 2.78,5.93 C19.2 1.81,5.42 v1.22,6.01
  Bottom 0.203: C17.2 2.24,4.62 1.22,5.64 | v1.22,6.01 | R3.1 | C21.2 5.04,27.03 5.03,27.04 C5.2
  Bottom 0.254: U$30.VSS 10.76,21.95 | S3.4 8.16,3.36 12.62,3.36 S3.3 | C20.2 2.9,30.31 2.87,30.28 2.78,30.28 v2.76,30.3 | C22.2 8.84,30.18 C10.2 | C29.2 3.59,17.41
  Bottom 0.305: v6.92,27.73 R3.1 | v2.82,19.07 3.59,18.3 3.59,17.41
  Bottom 0.406: v1.22,6.01 1.22,5.64 | v10.82,21.64 10.82,21.89 10.76,21.95
  other vias: 11.91,10.2 12.93,9.65 5.12,33.95 6.97,33.93 1.85,28.41 1.85,25.75 1.87,23.88 3.05,2.86 20.09,11.32 13.06,33.99
  pour Bottom (isolate 0.254): 3.11,37.4 18.17,37.4 22.75,32.82 22.75,-1.85 -2.17,-1.85 -2.17,32.12
  pour GND (isolate 0.254): -1.76,34.53 -0.76,35.53 19.96,35.53 22.8,32.69 22.8,-1.34 -1.76,-1.34
  pour Top: 9.63,11.73 14.14,11.73 14.14,7.28 9.63,7.28
  pour Bottom: 4.14,3.61 5.96,3.61 5.96,1.71 5.92,1.67 4.41,1.67 4.14,1.94
GND1
  pour Bottom: 2,23.12 3.73,23.12 3.73,21.61 2,21.61
IOSENSE  (via drill 0.25)
  Top 0.203: U1.7 15.84,9.73 16.21,10.11 v16.27,10.11 | J1.19 18.68,28.18 19.14,28.64 v19.14,29.38 19.14,30.05 IOSENSE.TP
  Route2 0.203: v16.27,10.11 15.66,10.72 15.66,11.18 16.11,11.63 16.65,11.63 16.93,11.92 16.93,21.84 18.09,23 18.09,28.33 v19.14,29.38
IREF
  Bottom 0.203: R3.2 7.14,25.52
  Bottom 0.305: 7.14,25.52 7.14,24.65 7.26,24.53 U$30.IREF
LDO_EN  (via drill 0.25)
  Top 0.203: R19.1 4.54,18.3 v4.54,18.34
  Top 0.305: R19.1 3.5,17.85 3.12,17.47 3.12,16.87 2.26,16.01 1.37,16.01 1.08,15.72 U3.3 | J3.2 13.57,15.84 v13.57,16.06
  Route2 0.203: v13.57,16.06 12.71,16.92 5.63,16.92 4.54,18.01 v4.54,18.34
LOW_BATT  (via drill 0.25)
  Top 0.203: R48.1 | R18.1 6.3,2.32 | Q5.2 9.79,2.04 9.51,2.32 | v18.49,15.87 17.98,15.87 17.34,15.23 17.34,12.22 16.79,11.67 15.85,11.67 15.79,11.73 U1.11
  Top 0.254: R18.1 R48.1 | 9.51,2.32 6.3,2.32 | Q5.2 v11.76,2.04 v11.76,2.03
  Top 0.305: R18.1 6.44,2.46 U6.5
  GND 0.305: v11.76,2.03 11.9,1.89 16.3,1.89 19.21,4.8 19.21,15.15 v18.49,15.87
N$1
  Bottom 0.203: 7.32,6.29 S3.2 | R15.1 5.06,8.11
  Bottom 0.254: 7.32,6.29 5.65,4.62 C17.1 4.62,4.65 4.62,6.62 R7.2 4.94,6.94 4.94,7.99 5.06,8.11 | S3.2 S3.1
N$2
  Bottom 0.203: 9.23,11.44 S1.2 | R9.2 10.17,11.44 | R8.2 12.67,8.25 | 10.81,8.25 C13.1 10.47,8.55
  Bottom 0.254: 9.23,11.44 9.23,9 9.68,8.55 10.47,8.55 | 10.17,11.44 S1.2 | 12.67,8.25 10.81,8.25
N$3
  Bottom 0.203: R12.2 16.62,2.37 17.92,3.67 C16.1 17.98,4.06 R13.1 17.98,6.2 17.74,6.44 16.65,6.44 15.44,7.65 15.44,13.58 16.13,14.27 | 16.12,14.27 16.13,14.28
  Bottom 0.254: 17.71,14.27 16.13,14.27 16.12,14.27 | 16.13,14.28 16.15,14.28 15.29,15.14 14,15.14 S2.2
  Bottom 0.305: S2.1 19.17,14.9 18.34,14.9 17.71,14.27 | S2.2 13.41,14.99
N$4
  Bottom 0.203: 16.51,27.38 Q4.3 16.39,27.44 13.98,27.44 13.42,26.88 Q2.1
  Bottom 0.305: R4.2 16.98,28.43 16.51,27.96 16.51,27.38
N$5
  Top 0.203: X2.P$1 17.54,3.96 | 18.75,3.96 C2.1
  Top 0.254: U1.1 15.5,6.59 15.5,4.01 15.9,3.61 X2.P$1 | 18.75,3.96 17.54,3.96
N$6
  Top 0.203: Q3.3 9.06,19.14 8.92,19 8.06,19 R5.2 8.05,16.99 6.63,15.56 Q1.1
N$7
  Top 0.203: C4.1 17.96,7.04 17.68,6.77 17.2,6.77 | X2.P$2 17.2,6.77 | U1.2 15.9,7.23 16.37,6.77 17.2,6.77
N$10
  Top 0.203: R11.1 1.21,3.95 1.53,4.26 | 3.54,4.23 2.81,4.23 C19.1
  Top 0.254: 4.54,4.41 4.41,4.53 3.84,4.53 3.54,4.23 | 4.54,4.41 U6.4 | R10.1 5.29,5.17 4.54,4.41 | 1.53,4.26 C19.1
N$17
  Top 0.254: U8.6 12.17,20.51 11.29,20.51 L7.1
N$19
  Top 0.203: 9.46,20.52 L7.2
  Top 0.305: BZ1.1 8.11,21.88 9.46,20.52
N$22
  Top 0.203: U8.4 14.07,20.64 12.78,20.64 12.78,21.49 13.65,22.36 13.65,23.57 13.29,23.93 10.57,23.93 | BZ1.2 6.82,30.34
  Top 0.305: 6.82,30.34 8.07,30.34 9.05,29.36 9.05,25.46 10.57,23.93
OP_SWITCH  (via drill 0.25)
  Top 0.203: J1.17 16.96,27.78 | J1.15 16.96,27.38 16.96,27.57 16.96,27.58 16.96,27.78 | Q5.3 11.61,1.39 12.04,0.96 OP_SWITCH.TP | v16.96,31.44 16.96,27.78
  Top 0.254: Q5.3 v7.95,1.38
  Route2 0.203: v16.96,31.44 16.11,31.44 14.99,32.55 14.37,32.55 10.71,28.89 9.53,28.89 8.68,28.04 8.68,26.78 12.99,22.48 12.99,21.03 10.56,18.6 7.14,18.6 5.92,19.82 v5.92,20.04
  GND 0.254: v5.92,20.04 5.92,18.76 4.66,17.5 4.66,7.09 7.95,3.8 v7.95,1.38
PWM_DAC  (via drill 0.25)
  Top 0.203: U1.12 15.45,12.32 v16.27,12.32
  Bottom 0.254: v16.27,12.32 16.69,12.32 17.27,11.74 17.27,9.74 17.5,9.51 18.17,9.51 R20.1
RXI  (via drill 0.25)
  Top 0.203: J1.5 17.33,25.38 17.01,25.06 17.01,23.67 v16.93,23.59 16.28,22.94 RXI.TP | U1.38 9.63,5.32 v9.89,5.06
  Route2 0.203: v16.93,23.59 16.81,23.59 15.94,22.72 15.94,13.76 13.02,10.84 10.8,10.84 9.85,9.89 9.85,5.11 v9.89,5.06
S_DOWN  (via drill 0.25)
  Top 0.203: U1.13 14.63,13.52 14.84,13.73 v14.84,14.17
  Bottom 0.203: v14.84,14.17 14.84,7.47 16.5,5.81 16.82,5.81 R13.2
S_POWER  (via drill 0.25)
  Top 0.203: U1.30 7.91,9.73 7.3,10.34 v7.3,10.43
  Bottom 0.203: R15.2 6.48,8.52 6.48,10 6.91,10.43 v7.3,10.43
S_UP  (via drill 0.25)
  Top 0.203: U1.14 14.13,13.73 14.14,13.73 13.96,13.91 v13.96,14.09
  Bottom 0.203: v13.96,14.09 13.96,13.55 14.32,13.19 14.32,8.74 R8.1
SCL  (via drill 0.25)
  Top 0.203: U1.32 7.91,8.73 7.77,8.59 v7.26,8.59
  GND 0.203: 8.89,20 v8.54,20.35
  GND 0.254: v7.26,8.59 8.33,8.59 8.89,9.15 8.89,20
  Bottom 0.203: U$30.SCL 8.66,24.41 9.77,25.51 R1.1
  Bottom 0.254: U$30.SCL 8.66,20.25 8.54,20.38 v8.54,20.35
SDA  (via drill 0.25)
  Top 0.203: U1.31 7.49,9.23 v7.16,9.56
  GND 0.254: v7.16,9.56 7.2,9.6 7.77,9.6 8.24,10.07 8.24,19.47 v7.74,19.97
  Bottom 0.203: 7.98,23.23 U$30.SDA
  Bottom 0.254: U$30.SDA 7.96,21.37 7.74,21.14 v7.74,19.97
  Bottom 0.305: R2.1 7.98,25.14 7.98,23.23
SPARE1
  Top 0.203: J1.1 18.68,24.58 18.89,24.36 18.89,23.02
  pour Top: 18.36,23.92 19.43,23.92 19.43,22.42 18.36,22.42
SWCLK  (via drill 0.25)
  Top 0.203: U1.45 13.12,6 13.12,5.03 v13.53,4.62 | VBUS2.TP 12.95,26.58 J1.12 15.68,26.58 v15.69,26.59
  GND 0.203: v13.53,4.62 13.53,3.79 13.96,3.35 14.82,3.35 18.64,7.17 18.64,13.83 16.09,16.38 16.09,21.84 17.57,23.32 17.57,24.6 15.74,26.43 15.74,26.55 v15.69,26.59
SWDIO  (via drill 0.25)
  Top 0.203: U1.46 13.63,5.42 14.24,4.81 v14.24,3.98 | VBUS3.TP 12.12,24.91 12.76,25.55 v12.76,25.57 13.37,26.18 J1.10
  GND 0.254: v14.24,3.98 14.75,3.98 18.05,7.29 18.05,13.42 15.49,15.98 15.49,24.5 14.03,25.96 13.15,25.96 v12.76,25.57
TXO  (via drill 0.25)
  Top 0.203: U1.37 9.13,4.81 v9.06,4.73 | J1.7 16.7,25.78 16.37,25.44 | 16.37,25.44 16.29,25.36 v16.29,24.32 | 16.37,25.44 16.37,30.12 VBUS6.TP
  Route2 0.203: v16.29,24.32 15.53,23.56 15.53,13.93 13.1,11.5 10.77,11.5 9.22,9.95 9.22,4.89 v9.06,4.73
VBAT_LCD
  Bottom 0.203: 11.7,30.36 C25.1 | Q2.3 12.39,28.83 12.34,28.83 | 11.79,28.83 11.13,28.16 11.13,26.14 12.16,25.11
  Bottom 0.254: U$30.VBAT 12.16,25.11 | 11.7,30.36 11.7,29.47 12.34,28.83 11.79,28.83
VBUS  (via drill 0.25)
  Top 0.203: v5.77,17.68 5.42,17.68 | v12.35,2.68 12.25,2.78 9.4,2.78 8.99,3.2 8.99,3.7 8.68,4.01 R10.2 | R14.1 13.69,0.95 | v13.78,21.33 14.33,21.33 15.19,20.47 VBUS5.TP | J1.2 14.46,24.58 14.33,24.45 14.23,24.35 14.23,24.62 14.59,24.97 14.88,24.97 J1.4
  Top 0.254: 13.69,0.95 12.96,1.68 12.96,2.07 v12.35,2.68
  Top 0.305: 5.42,17.68 5.06,17.32 5.06,16.28 4.78,16 | U3.1 2.98,15.46 3.51,15.99 4.08,15.99 4.09,16 | R19.2 4.09,16 | 4.09,16 4.78,16 | 4.78,16 4.64,15.86 C6.1
  Top 0.406: v13.78,21.33 13.79,21.33 14.33,21.87 14.33,24.45
  Route2 0.203: v5.77,17.68 6.01,17.92 | v14.67,31.88 14.57,31.99 14.41,31.99 10.63,28.21 9.48,28.21 9.12,27.85 9.12,27.19 13.78,22.53 v13.78,21.33
  Route2 0.254: v13.78,21.33 13.78,20.98
  Route2 0.305: 13.78,20.98 10.72,17.92 6.01,17.92
  GND 0.203: v12.35,2.68 9.91,2.68 5.1,7.49 5.1,17.01 v5.77,17.68
  Bottom 0.203: 15.53,29.99 15.82,29.7 R4.1 | 13.73,21.33 v13.78,21.33
  Bottom 0.254: 15.82,30.73 v14.67,31.88 | U2.3 9.47,17.07 13.73,21.33 | C29.1 5.43,17.14 | 5.77,17.48 v5.77,17.68
  Bottom 0.305: 15.53,29.99 14.19,29.99 13.25,29.05 13.25,28.32 12.78,27.85 12.1,27.85 11.69,27.44 Q2.2 | R4.1 15.82,30.73
  Bottom 0.406: 5.43,17.14 5.77,17.48
VCC  (via drill 0.25)
  Top 0.203: U1.6 16.29,9.23 17.85,10.8 17.89,10.8 | U1.17 12.63,13.39 12.14,13.88 | U1.36 7.93,6.73 7.27,7.39 | U1.44 12.63,4.52 12.89,4.27 v12.89,4.05 | R48.2 4.19,0.91 | 12.61,31.38 VBUS.TP | 18.2,14.31 C11.1 | C3.1 17.89,10.8 | 17.89,10.8 18.19,10.8
  Top 0.254: C7.1 6.13,13.39 | v20.05,16.18 20.05,16.16 18.2,14.31 | 4.19,0.91 v3.65,1.44 | 7.88,15.14 Q1.2 | v13.77,33.22 13.77,32.54 12.61,31.38 | v6.88,19.94 6.88,19.01 R5.1
  Top 0.305: 7.27,7.39 v7.27,7.73 | 12.14,13.88 v11.14,13.88 | 6.13,13.39 7.88,15.14 | 18.19,10.8 C9.1 C11.1
  Top 0.406: v6.47,13.65 6.13,13.31 C7.1 6.04,11.84 C8.1 3.17,11.84 U3.5
  Bottom 0.203: v12.89,4.05 13.62,3.32 14.76,3.32 15.2,2.87 R12.1 | 11.12,13.88 v11.14,13.88
  Bottom 0.254: R7.1 5.86,6.73 6.44,7.31 6.85,7.31 v7.27,7.73 | R9.1 10.37,12.98 11.12,13.73 11.12,13.88
  pour Route2 (isolate 0.254, rank 2): -1.89,36.87 18.62,36.87 22.86,32.63 22.86,-2.04 -1.89,-2.04
VCC_2  (via drill 0.25)
  Top 0.203: C15.1 | 4.93,19.47 C26.1 4.9,20.04 4.67,20.27 2.38,20.27 VCC_2.TP | 6.89,17.51 Q1.3 6.85,17.51 | C18.1 6.36,8.35 6.44,8.27 | v14.11,30.77 14.17,30.77 15.55,29.4 15.55,27.78 | J1.16 15.45,27.38 15.55,27.49 15.55,27.6 15.55,27.61 15.55,27.78 | J1.18 15.55,27.78
  Top 0.254: U8.5 13.15,19.79 13.15,19.28 14.14,18.29 v14.2,18.29 | 6.89,17.51 4.93,19.47 | v5.82,14.43 5.84,14.45
  Top 0.305: v14.2,18.29 14.48,18.02 C15.1 | 6.44,8.27 U6.1 | 5.84,14.45 5.84,16.5 6.85,17.51 | C18.1 6.09,9.01 v5.78,9.31
  Route2 0.203: v14.11,30.77 14.03,30.77 10.73,27.47 v9.85,27.47 9.81,27.43 9.81,27.26 14.52,22.54 14.52,18.61 v14.2,18.29 14.32,18.17 14.32,15.77 13.93,15.38 13.26,15.38 12.19,16.45 | v5.82,14.43 5.74,14.35
  Route2 0.305: 5.74,14.35 5.74,9.35 v5.78,9.31 | 12.19,16.45 7.84,16.45 v5.82,14.43
  Bottom 0.203: R1.2 R2.2 | 9.82,27.44 v9.85,27.47 | R6.2 7.75,30.34 7.92,30.17 7.92,29.39 8.11,29.2 8.66,29.2 C10.1 8.71,28.63 8.84,28.5 10.15,28.5 10.23,28.42 10.26,28.45 | U$30.VDD 10.01,23.3 10.01,24.23 10.61,24.83 10.61,27.57 10.28,27.9 10.26,27.88 10.26,28.45 | C22.1 10.26,28.45
  Bottom 0.305: R1.2 9.82,27.44 | v9.85,27.47 10.26,27.88
VCC_OLED
  Bottom 0.203: C21.1 5.17,25.34
  Bottom 0.305: 5.17,25.34 4.95,25.56 4.1,25.56 C5.1 | C21.1 5.22,23.89 U$30.VCC
VCOMH
  Bottom 0.203: C20.1 4.48,28.16 5.87,28.16 6.04,27.99 6.04,25.01 6.56,24.49 U$30.VCOMH
VDDCORE
  Top 0.203: U1.43 12.13,4.1 C1.1
VINSENSE
  Top 0.203: U1.47 14.13,5.53 14.9,4.76 14.9,3.09 | R14.2 13.79,3.01 13.91,3.14 14.86,3.14 14.9,3.09 | C28.1 R17.2 14.9,2.47 14.9,3.09
VOUTSENSE  (via drill 0.25, 0.35)
  Top 0.203: U1.10 15.95,11.23 16.22,10.96 v16.36,10.96 | v19.11,26.59 19.09,26.58 18.7,26.98 J1.13 | VOUTSENSE.TP 17.17,19.88 v17.72,20.44
  Route2 0.203: v19.11,26.59 18.51,25.99 18.51,22.78 17.34,21.61 17.34,20.88 17.34,20.82 | v16.36,10.96 16.85,10.96 17.34,11.45 17.34,20.82 | v17.72,20.44 17.34,20.82

### Text on the board
tNames: VCC | TXO | IO_SENSE | !RESET | SWCLK | SWDIO | GND | RXI | VBUS | FB_DAC | VOUT / SENSE | EN_DCDC | OP_SWITCH
bNames: - | - | - | - | - | - | GND | BATT_CPU / rover R-1 / May'23-V3 | GND